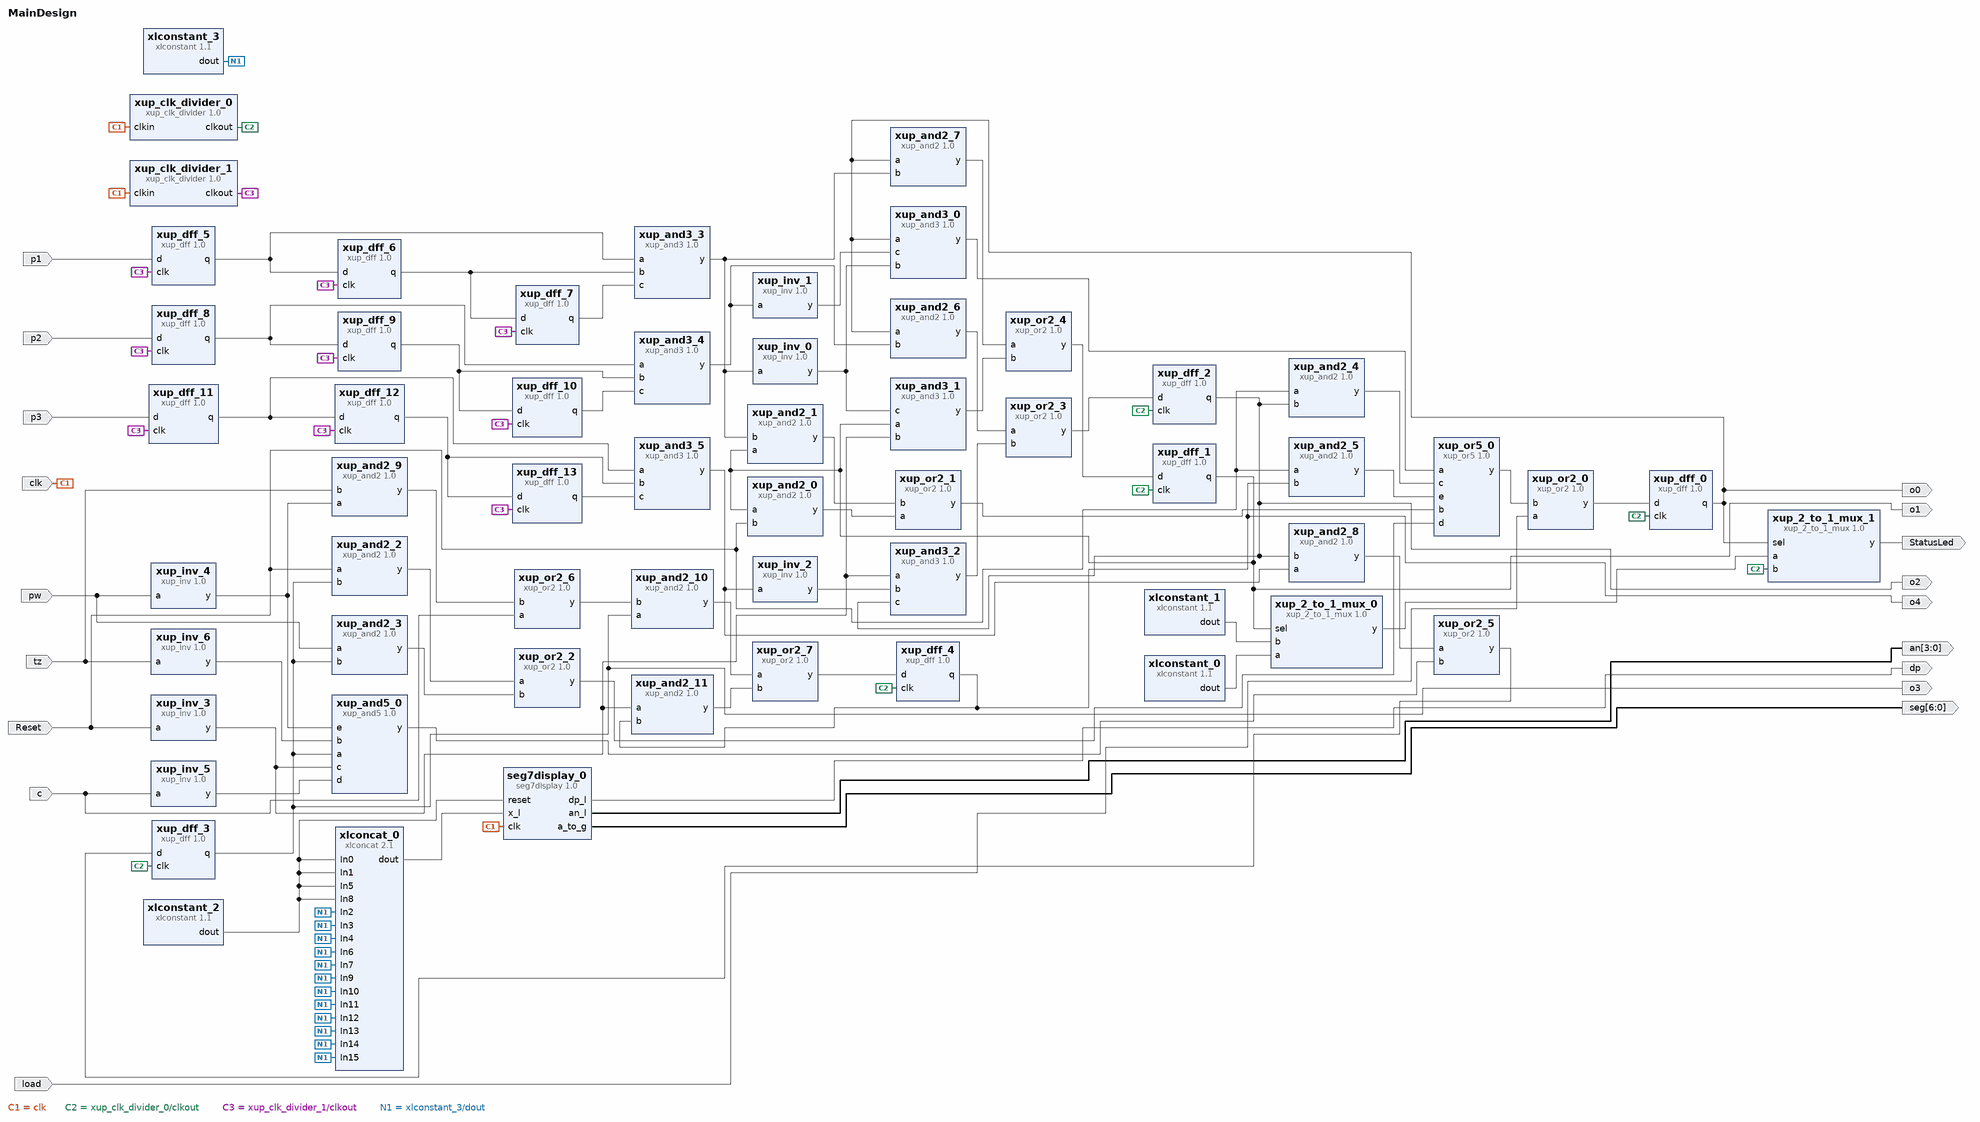
[diagram p0: block diagram of the top level]
# Vivado block design MainDesign, xc7a35tcpg236-1, Vivado 2018.1
create_bd_design MainDesign

create_bd_port -dir I p1
create_bd_port -dir I p2
create_bd_port -dir I p3
create_bd_port -dir I Reset
create_bd_port -dir I pw
create_bd_port -dir I tz
create_bd_port -dir I c
create_bd_port -dir I -type clk clk
create_bd_port -dir I load
create_bd_port -dir O o0
create_bd_port -dir O o1
create_bd_port -dir O o2
create_bd_port -dir O o3
create_bd_port -dir O o4
create_bd_port -dir O StatusLed
create_bd_port -dir O -from 6 -to 0 seg
create_bd_port -dir O -from 3 -to 0 an
create_bd_port -dir O dp

create_bd_cell -type ip -vlnv xilinx.com:XUP:xup_dff:1.0 xup_dff_0
create_bd_cell -type ip -vlnv xilinx.com:XUP:xup_dff:1.0 xup_dff_1
create_bd_cell -type ip -vlnv xilinx.com:XUP:xup_dff:1.0 xup_dff_2
create_bd_cell -type ip -vlnv xilinx.com:XUP:xup_dff:1.0 xup_dff_3
create_bd_cell -type ip -vlnv xilinx.com:XUP:xup_dff:1.0 xup_dff_4
create_bd_cell -type ip -vlnv xilinx.com:XUP:xup_or5:1.0 xup_or5_0
create_bd_cell -type ip -vlnv xilinx.com:XUP:xup_or2:1.0 xup_or2_0
create_bd_cell -type ip -vlnv xilinx.com:XUP:xup_inv:1.0 xup_inv_0
create_bd_cell -type ip -vlnv xilinx.com:XUP:xup_inv:1.0 xup_inv_1
create_bd_cell -type ip -vlnv xilinx.com:XUP:xup_inv:1.0 xup_inv_2
create_bd_cell -type ip -vlnv xilinx.com:XUP:xup_and3:1.0 xup_and3_0
create_bd_cell -type ip -vlnv xilinx.com:XUP:xup_and2:1.0 xup_and2_0
create_bd_cell -type ip -vlnv xilinx.com:XUP:xup_and2:1.0 xup_and2_1
create_bd_cell -type ip -vlnv xilinx.com:XUP:xup_or2:1.0 xup_or2_1
create_bd_cell -type ip -vlnv xilinx.com:XUP:xup_inv:1.0 xup_inv_3
create_bd_cell -type ip -vlnv xilinx.com:XUP:xup_and2:1.0 xup_and2_2
create_bd_cell -type ip -vlnv xilinx.com:XUP:xup_and2:1.0 xup_and2_3
create_bd_cell -type ip -vlnv xilinx.com:XUP:xup_inv:1.0 xup_inv_4
create_bd_cell -type ip -vlnv xilinx.com:XUP:xup_and2:1.0 xup_and2_4
create_bd_cell -type ip -vlnv xilinx.com:XUP:xup_or2:1.0 xup_or2_2
create_bd_cell -type ip -vlnv xilinx.com:XUP:xup_and2:1.0 xup_and2_5
create_bd_cell -type ip -vlnv xilinx.com:XUP:xup_and3:1.0 xup_and3_1
create_bd_cell -type ip -vlnv xilinx.com:XUP:xup_and3:1.0 xup_and3_2
create_bd_cell -type ip -vlnv xilinx.com:XUP:xup_or2:1.0 xup_or2_3
create_bd_cell -type ip -vlnv xilinx.com:XUP:xup_and2:1.0 xup_and2_6
create_bd_cell -type ip -vlnv xilinx.com:XUP:xup_and2:1.0 xup_and2_7
create_bd_cell -type ip -vlnv xilinx.com:XUP:xup_or2:1.0 xup_or2_4
create_bd_cell -type ip -vlnv xilinx.com:XUP:xup_inv:1.0 xup_inv_5
create_bd_cell -type ip -vlnv xilinx.com:XUP:xup_inv:1.0 xup_inv_6
create_bd_cell -type ip -vlnv xilinx.com:XUP:xup_and5:1.0 xup_and5_0
create_bd_cell -type ip -vlnv xilinx.com:XUP:xup_and2:1.0 xup_and2_8
create_bd_cell -type ip -vlnv xilinx.com:XUP:xup_or2:1.0 xup_or2_5
create_bd_cell -type ip -vlnv xilinx.com:XUP:xup_or2:1.0 xup_or2_6
create_bd_cell -type ip -vlnv xilinx.com:XUP:xup_and2:1.0 xup_and2_9
create_bd_cell -type ip -vlnv xilinx.com:XUP:xup_and2:1.0 xup_and2_10
create_bd_cell -type ip -vlnv xilinx.com:XUP:xup_and2:1.0 xup_and2_11
create_bd_cell -type ip -vlnv xilinx.com:XUP:xup_or2:1.0 xup_or2_7
create_bd_cell -type ip -vlnv xilinx.com:XUP:xup_clk_divider:1.0 xup_clk_divider_0
set_property -dict {CONFIG.SIZE 100000000} [get_bd_cells xup_clk_divider_0]
create_bd_cell -type ip -vlnv xilinx.com:XUP:xup_dff:1.0 xup_dff_5
create_bd_cell -type ip -vlnv xilinx.com:XUP:xup_dff:1.0 xup_dff_6
create_bd_cell -type ip -vlnv xilinx.com:XUP:xup_dff:1.0 xup_dff_7
create_bd_cell -type ip -vlnv xilinx.com:XUP:xup_and3:1.0 xup_and3_3
create_bd_cell -type ip -vlnv xilinx.com:XUP:xup_clk_divider:1.0 xup_clk_divider_1
set_property -dict {CONFIG.SIZE 50000000} [get_bd_cells xup_clk_divider_1]
create_bd_cell -type ip -vlnv xilinx.com:XUP:xup_dff:1.0 xup_dff_8
create_bd_cell -type ip -vlnv xilinx.com:XUP:xup_dff:1.0 xup_dff_9
create_bd_cell -type ip -vlnv xilinx.com:XUP:xup_dff:1.0 xup_dff_10
create_bd_cell -type ip -vlnv xilinx.com:XUP:xup_and3:1.0 xup_and3_4
create_bd_cell -type ip -vlnv xilinx.com:XUP:xup_dff:1.0 xup_dff_11
create_bd_cell -type ip -vlnv xilinx.com:XUP:xup_dff:1.0 xup_dff_12
create_bd_cell -type ip -vlnv xilinx.com:XUP:xup_dff:1.0 xup_dff_13
create_bd_cell -type ip -vlnv xilinx.com:XUP:xup_and3:1.0 xup_and3_5
create_bd_cell -type ip -vlnv xilinx.com:XUP:xup_2_to_1_mux:1.0 xup_2_to_1_mux_0
create_bd_cell -type ip -vlnv xilinx.com:XUP:xup_2_to_1_mux:1.0 xup_2_to_1_mux_1
create_bd_cell -type ip -vlnv xilinx.com:ip:xlconstant:1.1 xlconstant_0
create_bd_cell -type ip -vlnv xilinx.com:ip:xlconstant:1.1 xlconstant_1
set_property -dict {CONFIG.CONST_VAL 0} [get_bd_cells xlconstant_1]
create_bd_cell -type ip -vlnv xilinx.com:XUP:seg7display:1.0 seg7display_0
create_bd_cell -type ip -vlnv xilinx.com:ip:xlconcat:2.1 xlconcat_0
set_property -dict {CONFIG.NUM_PORTS 16} [get_bd_cells xlconcat_0]
create_bd_cell -type ip -vlnv xilinx.com:ip:xlconstant:1.1 xlconstant_2
set_property -dict {CONFIG.CONST_VAL 0} [get_bd_cells xlconstant_2]
create_bd_cell -type ip -vlnv xilinx.com:ip:xlconstant:1.1 xlconstant_3

# ---- connections ----

connect_bd_net [get_bd_pins xup_or5_0/y] [get_bd_pins xup_or2_0/b]
connect_bd_net [get_bd_pins xup_or2_0/y] [get_bd_pins xup_dff_0/d]
connect_bd_net [get_bd_pins xup_inv_0/y] [get_bd_pins xup_and3_0/b] [get_bd_pins xup_and3_1/c]
connect_bd_net [get_bd_pins xup_inv_1/y] [get_bd_pins xup_and3_0/c]
connect_bd_net [get_bd_pins xup_dff_0/q] \
  [get_bd_pins xup_and3_0/a] [get_bd_pins xup_and2_6/a] [get_bd_pins xup_and2_7/a] [get_bd_ports o0] \
  [get_bd_pins xup_2_to_1_mux_1/sel]
connect_bd_net [get_bd_pins xup_and3_0/y] [get_bd_pins xup_or5_0/a]
connect_bd_net [get_bd_ports Reset] \
  [get_bd_pins xup_inv_3/a] [get_bd_pins xup_and2_0/b] [get_bd_pins xup_and2_2/a] [get_bd_pins xup_and2_4/a] \
  [get_bd_pins xup_and2_5/a]
connect_bd_net [get_bd_pins xup_dff_1/q] \
  [get_bd_pins xup_and2_0/a] [get_bd_pins xup_and2_1/a] [get_bd_pins xup_and3_1/a] [get_bd_ports o1] \
  [get_bd_pins xup_2_to_1_mux_0/sel]
connect_bd_net [get_bd_pins xup_and2_0/y] [get_bd_pins xup_or2_1/a]
connect_bd_net [get_bd_pins xup_and2_1/y] [get_bd_pins xup_or2_1/b]
connect_bd_net [get_bd_pins xup_or2_1/y] [get_bd_pins xup_or5_0/b]
connect_bd_net [get_bd_ports pw] [get_bd_pins xup_inv_4/a] [get_bd_pins xup_and2_3/a]
connect_bd_net [get_bd_pins xup_and2_4/y] [get_bd_pins xup_or5_0/c]
connect_bd_net [get_bd_pins xup_and2_2/y] [get_bd_pins xup_or2_2/a]
connect_bd_net [get_bd_pins xup_and2_3/y] [get_bd_pins xup_or2_2/b]
connect_bd_net [get_bd_pins xup_dff_2/q] [get_bd_pins xup_and2_4/b] [get_bd_pins xup_and3_2/c] [get_bd_pins xup_and2_8/b] [get_bd_ports o2]
connect_bd_net [get_bd_pins xup_dff_3/q] \
  [get_bd_pins xup_and2_2/b] [get_bd_pins xup_and2_3/b] [get_bd_pins xup_and5_0/a] [get_bd_pins xup_and2_10/a] \
  [get_bd_ports o3]
connect_bd_net [get_bd_pins xup_or2_2/y] [get_bd_pins xup_or5_0/d]
connect_bd_net [get_bd_pins xup_dff_4/q] [get_bd_pins xup_and2_5/b] [get_bd_pins xup_and2_11/b] [get_bd_ports o4]
connect_bd_net [get_bd_pins xup_and2_5/y] [get_bd_pins xup_or5_0/e]
connect_bd_net [get_bd_pins xup_inv_3/y] [get_bd_pins xup_and3_1/b] [get_bd_pins xup_and3_2/a] [get_bd_pins xup_and5_0/c] [get_bd_pins xup_and2_11/a]
connect_bd_net [get_bd_pins xup_and2_6/y] [get_bd_pins xup_or2_3/a]
connect_bd_net [get_bd_pins xup_or2_3/y] [get_bd_pins xup_dff_2/d]
connect_bd_net [get_bd_pins xup_and3_1/y] [get_bd_pins xup_or2_4/b]
connect_bd_net [get_bd_pins xup_or2_4/y] [get_bd_pins xup_dff_1/d]
connect_bd_net [get_bd_pins xup_and2_7/y] [get_bd_pins xup_or2_4/a]
connect_bd_net [get_bd_pins xup_inv_2/y] [get_bd_pins xup_and3_2/b]
connect_bd_net [get_bd_pins xup_and3_2/y] [get_bd_pins xup_or2_3/b]
connect_bd_net [get_bd_ports c] [get_bd_pins xup_inv_5/a] [get_bd_pins xup_or2_6/a]
connect_bd_net [get_bd_ports tz] [get_bd_pins xup_inv_6/a] [get_bd_pins xup_and2_9/b]
connect_bd_net [get_bd_pins xup_inv_6/y] [get_bd_pins xup_and5_0/b]
connect_bd_net [get_bd_pins xup_inv_5/y] [get_bd_pins xup_and5_0/d]
connect_bd_net [get_bd_pins xup_inv_4/y] [get_bd_pins xup_and5_0/e] [get_bd_pins xup_and2_9/a]
connect_bd_net [get_bd_pins xup_and2_8/y] [get_bd_pins xup_or2_5/a]
connect_bd_net [get_bd_pins xup_and5_0/y] [get_bd_pins xup_or2_5/b]
connect_bd_net [get_bd_pins xup_or2_5/y] [get_bd_pins xup_dff_3/d]
connect_bd_net [get_bd_pins xup_and2_9/y] [get_bd_pins xup_or2_6/b]
connect_bd_net [get_bd_pins xup_or2_6/y] [get_bd_pins xup_and2_10/b]
connect_bd_net [get_bd_pins xup_and2_10/y] [get_bd_pins xup_or2_7/a]
connect_bd_net [get_bd_pins xup_and2_11/y] [get_bd_pins xup_or2_7/b]
connect_bd_net [get_bd_pins xup_or2_7/y] [get_bd_pins xup_dff_4/d]
connect_bd_net [get_bd_ports clk] [get_bd_pins xup_clk_divider_0/clkin] [get_bd_pins xup_clk_divider_1/clkin] [get_bd_pins seg7display_0/clk]
connect_bd_net [get_bd_pins xup_clk_divider_0/clkout] \
  [get_bd_pins xup_dff_4/clk] [get_bd_pins xup_dff_3/clk] [get_bd_pins xup_dff_2/clk] [get_bd_pins xup_dff_1/clk] \
  [get_bd_pins xup_dff_0/clk] [get_bd_pins xup_2_to_1_mux_1/b]
connect_bd_net [get_bd_ports load] [get_bd_pins xup_or2_0/a]
connect_bd_net [get_bd_pins xup_dff_5/q] [get_bd_pins xup_dff_6/d] [get_bd_pins xup_and3_3/a]
connect_bd_net [get_bd_pins xup_dff_6/q] [get_bd_pins xup_dff_7/d] [get_bd_pins xup_and3_3/b]
connect_bd_net [get_bd_pins xup_clk_divider_1/clkout] \
  [get_bd_pins xup_dff_5/clk] [get_bd_pins xup_dff_6/clk] [get_bd_pins xup_dff_7/clk] [get_bd_pins xup_dff_8/clk] \
  [get_bd_pins xup_dff_9/clk] [get_bd_pins xup_dff_10/clk] [get_bd_pins xup_dff_11/clk] [get_bd_pins xup_dff_12/clk] \
  [get_bd_pins xup_dff_13/clk]
connect_bd_net [get_bd_pins xup_dff_7/q] [get_bd_pins xup_and3_3/c]
connect_bd_net -net p1_1 [get_bd_ports p1] [get_bd_pins xup_dff_5/d]
connect_bd_net [get_bd_pins xup_and3_3/y] [get_bd_pins xup_inv_0/a] [get_bd_pins xup_and2_1/b] [get_bd_pins xup_and2_7/b]
connect_bd_net [get_bd_pins xup_dff_8/q] [get_bd_pins xup_dff_9/d] [get_bd_pins xup_and3_4/a]
connect_bd_net [get_bd_pins xup_dff_9/q] [get_bd_pins xup_dff_10/d] [get_bd_pins xup_and3_4/b]
connect_bd_net [get_bd_pins xup_dff_10/q] [get_bd_pins xup_and3_4/c]
connect_bd_net -net p2_1 [get_bd_ports p2] [get_bd_pins xup_dff_8/d]
connect_bd_net [get_bd_pins xup_and3_4/y] [get_bd_pins xup_inv_1/a] [get_bd_pins xup_and2_6/b]
connect_bd_net [get_bd_pins xup_dff_11/q] [get_bd_pins xup_dff_12/d] [get_bd_pins xup_and3_5/a]
connect_bd_net [get_bd_pins xup_dff_12/q] [get_bd_pins xup_dff_13/d] [get_bd_pins xup_and3_5/b]
connect_bd_net [get_bd_pins xup_dff_13/q] [get_bd_pins xup_and3_5/c]
connect_bd_net -net p3_1 [get_bd_ports p3] [get_bd_pins xup_dff_11/d]
connect_bd_net [get_bd_pins xup_and3_5/y] [get_bd_pins xup_inv_2/a] [get_bd_pins xup_and2_8/a]
connect_bd_net [get_bd_pins xup_2_to_1_mux_1/y] [get_bd_ports StatusLed]
connect_bd_net [get_bd_pins xlconstant_1/dout] [get_bd_pins xup_2_to_1_mux_0/b]
connect_bd_net [get_bd_pins xlconstant_0/dout] [get_bd_pins xup_2_to_1_mux_0/a]
connect_bd_net [get_bd_pins xup_2_to_1_mux_0/y] [get_bd_pins xup_2_to_1_mux_1/a]
connect_bd_net [get_bd_pins xlconstant_3/dout] \
  [get_bd_pins xlconcat_0/In14] [get_bd_pins xlconcat_0/In15] [get_bd_pins xlconcat_0/In13] [get_bd_pins xlconcat_0/In12] \
  [get_bd_pins xlconcat_0/In11] [get_bd_pins xlconcat_0/In10] [get_bd_pins xlconcat_0/In9] [get_bd_pins xlconcat_0/In7] \
  [get_bd_pins xlconcat_0/In6] [get_bd_pins xlconcat_0/In4] [get_bd_pins xlconcat_0/In3] [get_bd_pins xlconcat_0/In2]
connect_bd_net [get_bd_pins xlconstant_2/dout] \
  [get_bd_pins xlconcat_0/In8] [get_bd_pins xlconcat_0/In5] [get_bd_pins xlconcat_0/In1] [get_bd_pins xlconcat_0/In0] \
  [get_bd_pins seg7display_0/reset]
connect_bd_net [get_bd_pins xlconcat_0/dout] [get_bd_pins seg7display_0/x_l]
connect_bd_net [get_bd_pins seg7display_0/dp_l] [get_bd_ports dp]
connect_bd_net [get_bd_pins seg7display_0/an_l] [get_bd_ports an]
connect_bd_net [get_bd_pins seg7display_0/a_to_g] [get_bd_ports seg]

validate_bd_design
save_bd_design
